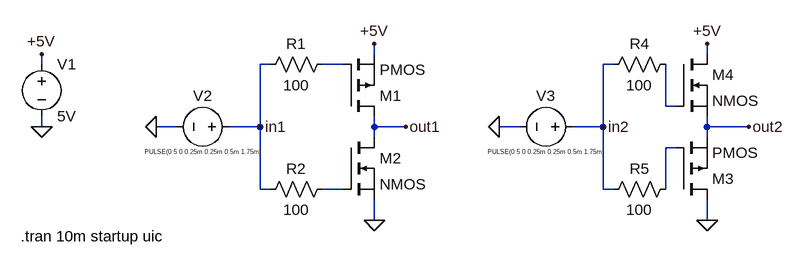
[diagram p0: schematic mosfet_logic.asc]
mosfet_logic.asc, the LTspice schematic file:
Version 4
SHEET 1 1256 680
WIRE 160 -144 160 -160
WIRE 672 -144 672 -160
WIRE -352 -128 -352 -144
WIRE 0 -128 -16 -128
WIRE 112 -128 80 -128
WIRE 528 -128 512 -128
WIRE 608 -64 608 -128
WIRE 624 -64 608 -64
WIRE -352 -32 -352 -48
WIRE -144 -32 -176 -32
WIRE -16 -32 -16 -128
WIRE -16 -32 -64 -32
WIRE 160 -32 160 -48
WIRE 208 -32 160 -32
WIRE 384 -32 352 -32
WIRE 512 -32 512 -128
WIRE 512 -32 464 -32
WIRE 672 -32 672 -48
WIRE 736 -32 672 -32
WIRE 160 -16 160 -32
WIRE 672 -16 672 -32
WIRE 624 0 608 0
WIRE -16 64 -16 -32
WIRE 0 64 -16 64
WIRE 112 64 80 64
WIRE 512 64 512 -32
WIRE 528 64 512 64
WIRE 608 64 608 0
WIRE 160 112 160 80
WIRE 672 112 672 80
FLAG 160 112 0
FLAG -352 -32 0
FLAG -352 -144 +5V
FLAG 160 -160 +5V
FLAG -176 -32 0
FLAG 208 -32 out1
FLAG -16 -32 in1
FLAG 352 -32 0
FLAG 672 112 0
FLAG 672 -160 +5V
FLAG 512 -32 in2
FLAG 736 -32 out2
SYMBOL nmos 112 -16 R0
SYMATTR InstName M2
SYMBOL voltage -352 -144 R0
WINDOW 123 0 0 Left 0
WINDOW 39 24 44 Left 2
SYMATTR InstName V1
SYMATTR Value 5V
SYMBOL res 96 -144 R90
WINDOW 0 0 56 VBottom 2
WINDOW 3 32 56 VTop 2
SYMATTR InstName R1
SYMATTR Value 100
SYMBOL res 96 48 R90
WINDOW 0 0 56 VBottom 2
WINDOW 3 32 56 VTop 2
SYMATTR InstName R2
SYMATTR Value 100
SYMBOL voltage -48 -32 R90
WINDOW 0 -32 56 VBottom 2
WINDOW 3 32 55 VTop 0
WINDOW 123 0 0 Left 0
WINDOW 39 0 0 Left 0
SYMATTR InstName V2
SYMATTR Value PULSE(0 5 0 0.25m 0.25m 0.5m 1.75m)
SYMBOL pmos 112 -48 M180
SYMATTR InstName M1
SYMBOL voltage 480 -32 R90
WINDOW 0 -32 56 VBottom 2
WINDOW 3 32 56 VTop 0
WINDOW 123 0 0 Left 0
WINDOW 39 0 0 Left 0
SYMATTR InstName V3
SYMATTR Value PULSE(0 5 0 0.25m 0.25m 0.5m 1.75m)
SYMBOL res 624 -144 R90
WINDOW 0 0 56 VBottom 2
WINDOW 3 32 56 VTop 2
SYMATTR InstName R4
SYMATTR Value 100
SYMBOL res 624 48 R90
WINDOW 0 0 56 VBottom 2
WINDOW 3 32 56 VTop 2
SYMATTR InstName R5
SYMATTR Value 100
SYMBOL pmos 624 80 M180
SYMATTR InstName M3
SYMBOL nmos 624 -144 R0
SYMATTR InstName M4
TEXT -384 136 Left 2 !.tran 10m startup uic

The netlist it stands for:
* mosfet_logic.asc
M2 out1 N004 0 0 NMOS
V1 +5V 0 5V
R1 N001 in1 100
R2 N004 in1 100
V2 in1 0 PULSE(0 5 0 0.25m 0.25m 0.5m 1.75m)
M1 out1 N001 +5V +5V PMOS
V3 in2 0 PULSE(0 5 0 0.25m 0.25m 0.5m 1.75m)
R4 N002 in2 100
R5 N003 in2 100
M3 0 N003 out2 out2 PMOS
M4 +5V N002 out2 out2 NMOS
.model NMOS NMOS
.model PMOS PMOS
.lib standard.mos
.tran 10m startup uic
.backanno
.end